# Altium project Power.PrjPCB
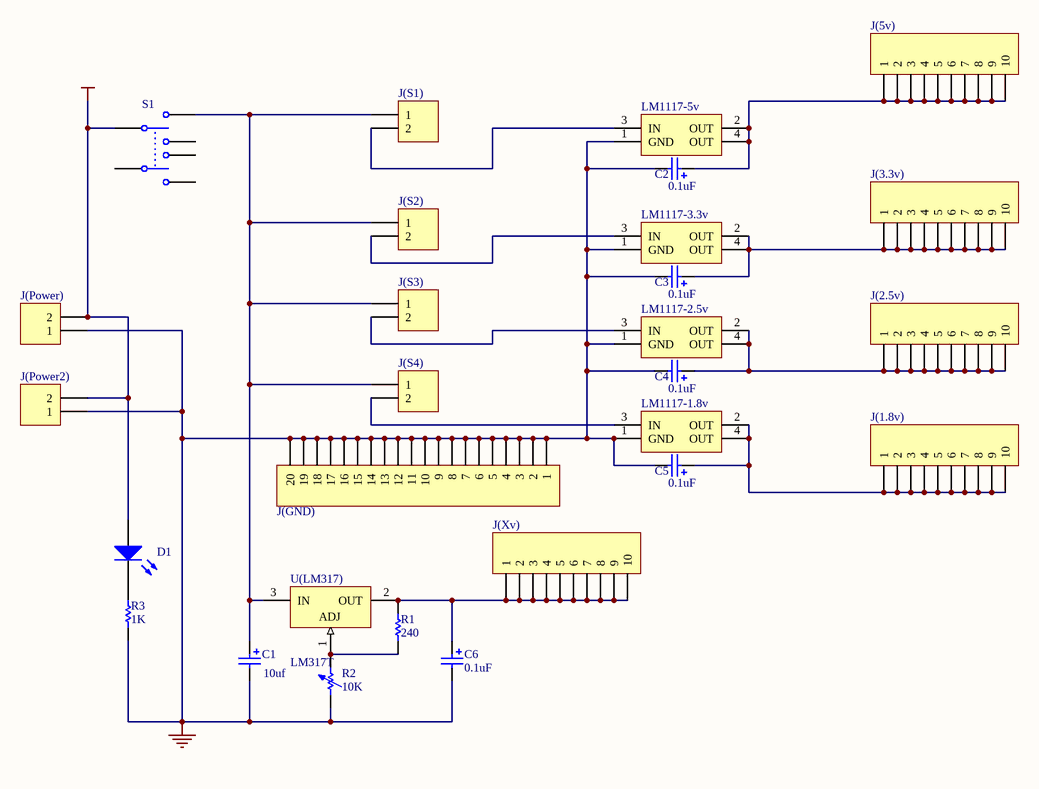
[diagram p0: Power.SchDoc]
1 sheet, 28 parts. Net scope: global (net labels, ports and power ports of the same name join across sheets).
Board file: Power.PcbDoc

## Sheet Power.SchDoc
size A4

### Parts
C1  value 10uf  [CAPPR2-5X6.8]  (hidden comment: Cap Pol1)
C2  value 0.1uF  [CAPPR2-5X6.8]  (hidden comment: Cap Pol1)
C3  value 0.1uF  [CAPPR2-5X6.8]  (hidden comment: Cap Pol1)
C4  value 0.1uF  [CAPPR2-5X6.8]  (hidden comment: Cap Pol1)
C5  value 0.1uF  [CAPPR2-5X6.8]  (hidden comment: Cap Pol1)
C6  value 0.1uF  [CAPPR2-5X6.8]  (hidden comment: Cap Pol1)
D1  LED0  [HDR1X2]  (value not drawn)
J(1.8v)  Header 10  [HDR1X10]  (value not drawn)
J(2.5v)  Header 10  [HDR1X10]  (value not drawn)
J(3.3v)  Header 10  [HDR1X10]  (value not drawn)
J(5v)  Header 10  [HDR1X10]  (value not drawn)
J(GND)  Header 20  [HDR1X20]  (value not drawn)
J(Power2)  Header 2  [Power]  (value not drawn)
J(Power)  Header 2  [HDR1X2]  (value not drawn)
J(S1)  Header 2  [HDR1X2]  (value not drawn)
J(S2)  Header 2  [HDR1X2]  (value not drawn)
J(S3)  Header 2  [HDR1X2]  (value not drawn)
J(S4)  Header 2  [HDR1X2]  (value not drawn)
J(Xv)  Header 10  [HDR1X10]  (value not drawn)
LM1117-1.8v  REG1117-5  [ZZ311]  (value not drawn)
LM1117-2.5v  REG1117-5  [ZZ311]  (value not drawn)
LM1117-3.3v  REG1117-5  [ZZ311]  (value not drawn)
LM1117-5v  REG1117-5  [ZZ311]  (value not drawn)
R1  value 240  [AXIAL-0.3]  (hidden comment: Res1)
R2  value 10K  [PIN3]  (hidden comment: Res Adj1)
R3  value 1K  [AXIAL-0.3]  (hidden comment: Res1)
S1  SW-DPDT  [DPDT-6]  (value not drawn)
U(LM317)  LM317T  [TO-220]

### Nets
GND: C1.2 C2.2 C3.2 C4.2 C5.2 C6.2 J(GND).1 J(GND).2 J(GND).3 J(GND).4 J(GND).5 J(GND).6 J(GND).7 J(GND).8 J(GND).9 J(GND).10 J(GND).11 J(GND).12 J(GND).13 J(GND).14 J(GND).15 J(GND).16 J(GND).17 J(GND).18 J(GND).19 J(GND).20 J(Power2).1 J(Power).1 LM1117-1.8v.1(GND) LM1117-2.5v.1(GND) LM1117-3.3v.1(GND) LM1117-5v.1(GND) R2.1 R3.2
VCC: D1.1(A) J(Power2).2 J(Power).2 S1.1
NetC1_1: C1.1 J(S1).1 J(S2).1 J(S3).1 J(S4).1 S1.2 U(LM317).3(IN)
NetC2_1: C2.1 J(5v).1 J(5v).2 J(5v).3 J(5v).4 J(5v).5 J(5v).6 J(5v).7 J(5v).8 J(5v).9 J(5v).10 LM1117-5v.2(OUT) LM1117-5v.4(OUT)
NetC3_1: C3.1 J(3.3v).1 J(3.3v).2 J(3.3v).3 J(3.3v).4 J(3.3v).5 J(3.3v).6 J(3.3v).7 J(3.3v).8 J(3.3v).9 J(3.3v).10 LM1117-3.3v.2(OUT) LM1117-3.3v.4(OUT)
NetC4_1: C4.1 J(2.5v).1 J(2.5v).2 J(2.5v).3 J(2.5v).4 J(2.5v).5 J(2.5v).6 J(2.5v).7 J(2.5v).8 J(2.5v).9 J(2.5v).10 LM1117-2.5v.2(OUT) LM1117-2.5v.4(OUT)
NetC5_1: C5.1 J(1.8v).1 J(1.8v).2 J(1.8v).3 J(1.8v).4 J(1.8v).5 J(1.8v).6 J(1.8v).7 J(1.8v).8 J(1.8v).9 J(1.8v).10 LM1117-1.8v.2(OUT) LM1117-1.8v.4(OUT)
NetC6_1: C6.1 J(Xv).1 J(Xv).2 J(Xv).3 J(Xv).4 J(Xv).5 J(Xv).6 J(Xv).7 J(Xv).8 J(Xv).9 J(Xv).10 R1.2 U(LM317).2(OUT)
NetD1_2: D1.2(K) R3.1
NetJ(S1)_2: J(S1).2 LM1117-5v.3(IN)
NetJ(S2)_2: J(S2).2 LM1117-3.3v.3(IN)
NetJ(S3)_2: J(S3).2 LM1117-2.5v.3(IN)
NetJ(S4)_2: J(S4).2 LM1117-1.8v.3(IN)
NetR1_1: R1.1 R2.2 U(LM317).1(ADJ)

Not connected (* = marked no-connect by the designer): S1 3 4 5 6

### Library data of the parts
C1-C6 = Cap Pol1: Polarized Capacitor (Radial); Published: 8-Jun-2000; Revision: July-2002: Re-released for DXP Platform.; Publisher: Altium Limited
D1 = LED0: Typical INFRARED GaAs LED; Published: 8-Jun-2000; Revision: July-2002: Re-released for DXP Platform.; Publisher: Altium Limited
J(1.8v) J(2.5v) J(3.3v) J(5v) J(Xv) = Header 10: Header, 10-Pin; Revision: 17-Jul-2002: Re-released for DXP Platform.; Publisher: Altium Limited
J(GND) = Header 20: Header, 20-Pin; Revision: 17-Jul-2002: Re-released for DXP Platform.; Publisher: Altium Limited
J(Power2) J(Power) J(S1) J(S2) J(S3) J(S4) = Header 2: Header, 2-Pin; Revision: 17-Jul-2002: Re-released for DXP Platform.; Publisher: Altium Limited
LM1117-1.8v LM1117-2.5v LM1117-3.3v LM1117-5v = REG1117-5: 800mA and 1A Low Dropout Positive Regulator 2.85V, 3.3V, 5V, and Adjustable; Package Information: Latest Revision: revC; Published: 8-Jun-2000; Revision: 17-Jul-2002: Re-released for DXP Platform.; Datasheet: Latest Revision: Sep-1997; Package Reference: ZZ311; Publisher: Altium Limited
R1 R3 = Res1: Resistor; Published: 8-Jun-2000; Revision: July-2002: Re-released for DXP Platform.; Publisher: Altium Limited
R2 = Res Adj1: Variable Resistor; Set Position: 0.5; Published: 8-Jun-2000; Revision: July-2002: Re-released for DXP Platform.; Publisher: Altium Limited
S1 = SW-DPDT: Double-Pole, Double-Throw Switch; Published: 24-Mar-1999; Revision: July-2002: Re-released for DXP Platform.; Publisher: Altium Limited
U(LM317) = LM317T: Three-Terminal Adjustable Output Positive Voltage Regulator; Package Information: Latest Revision: 1997; Note: Heatsink surface connected to Pin 2; Code - JEDEC: TO-262-AA; Published: 15-Apr-2002; Datasheet: Latest Revision: 1996; Package Reference: 221A-06; Publisher: Altium Limited